# Altium schematic sheet ANALOG_PART1.SchDoc
size A3; SheetNumber: 1; SheetTotal: 3
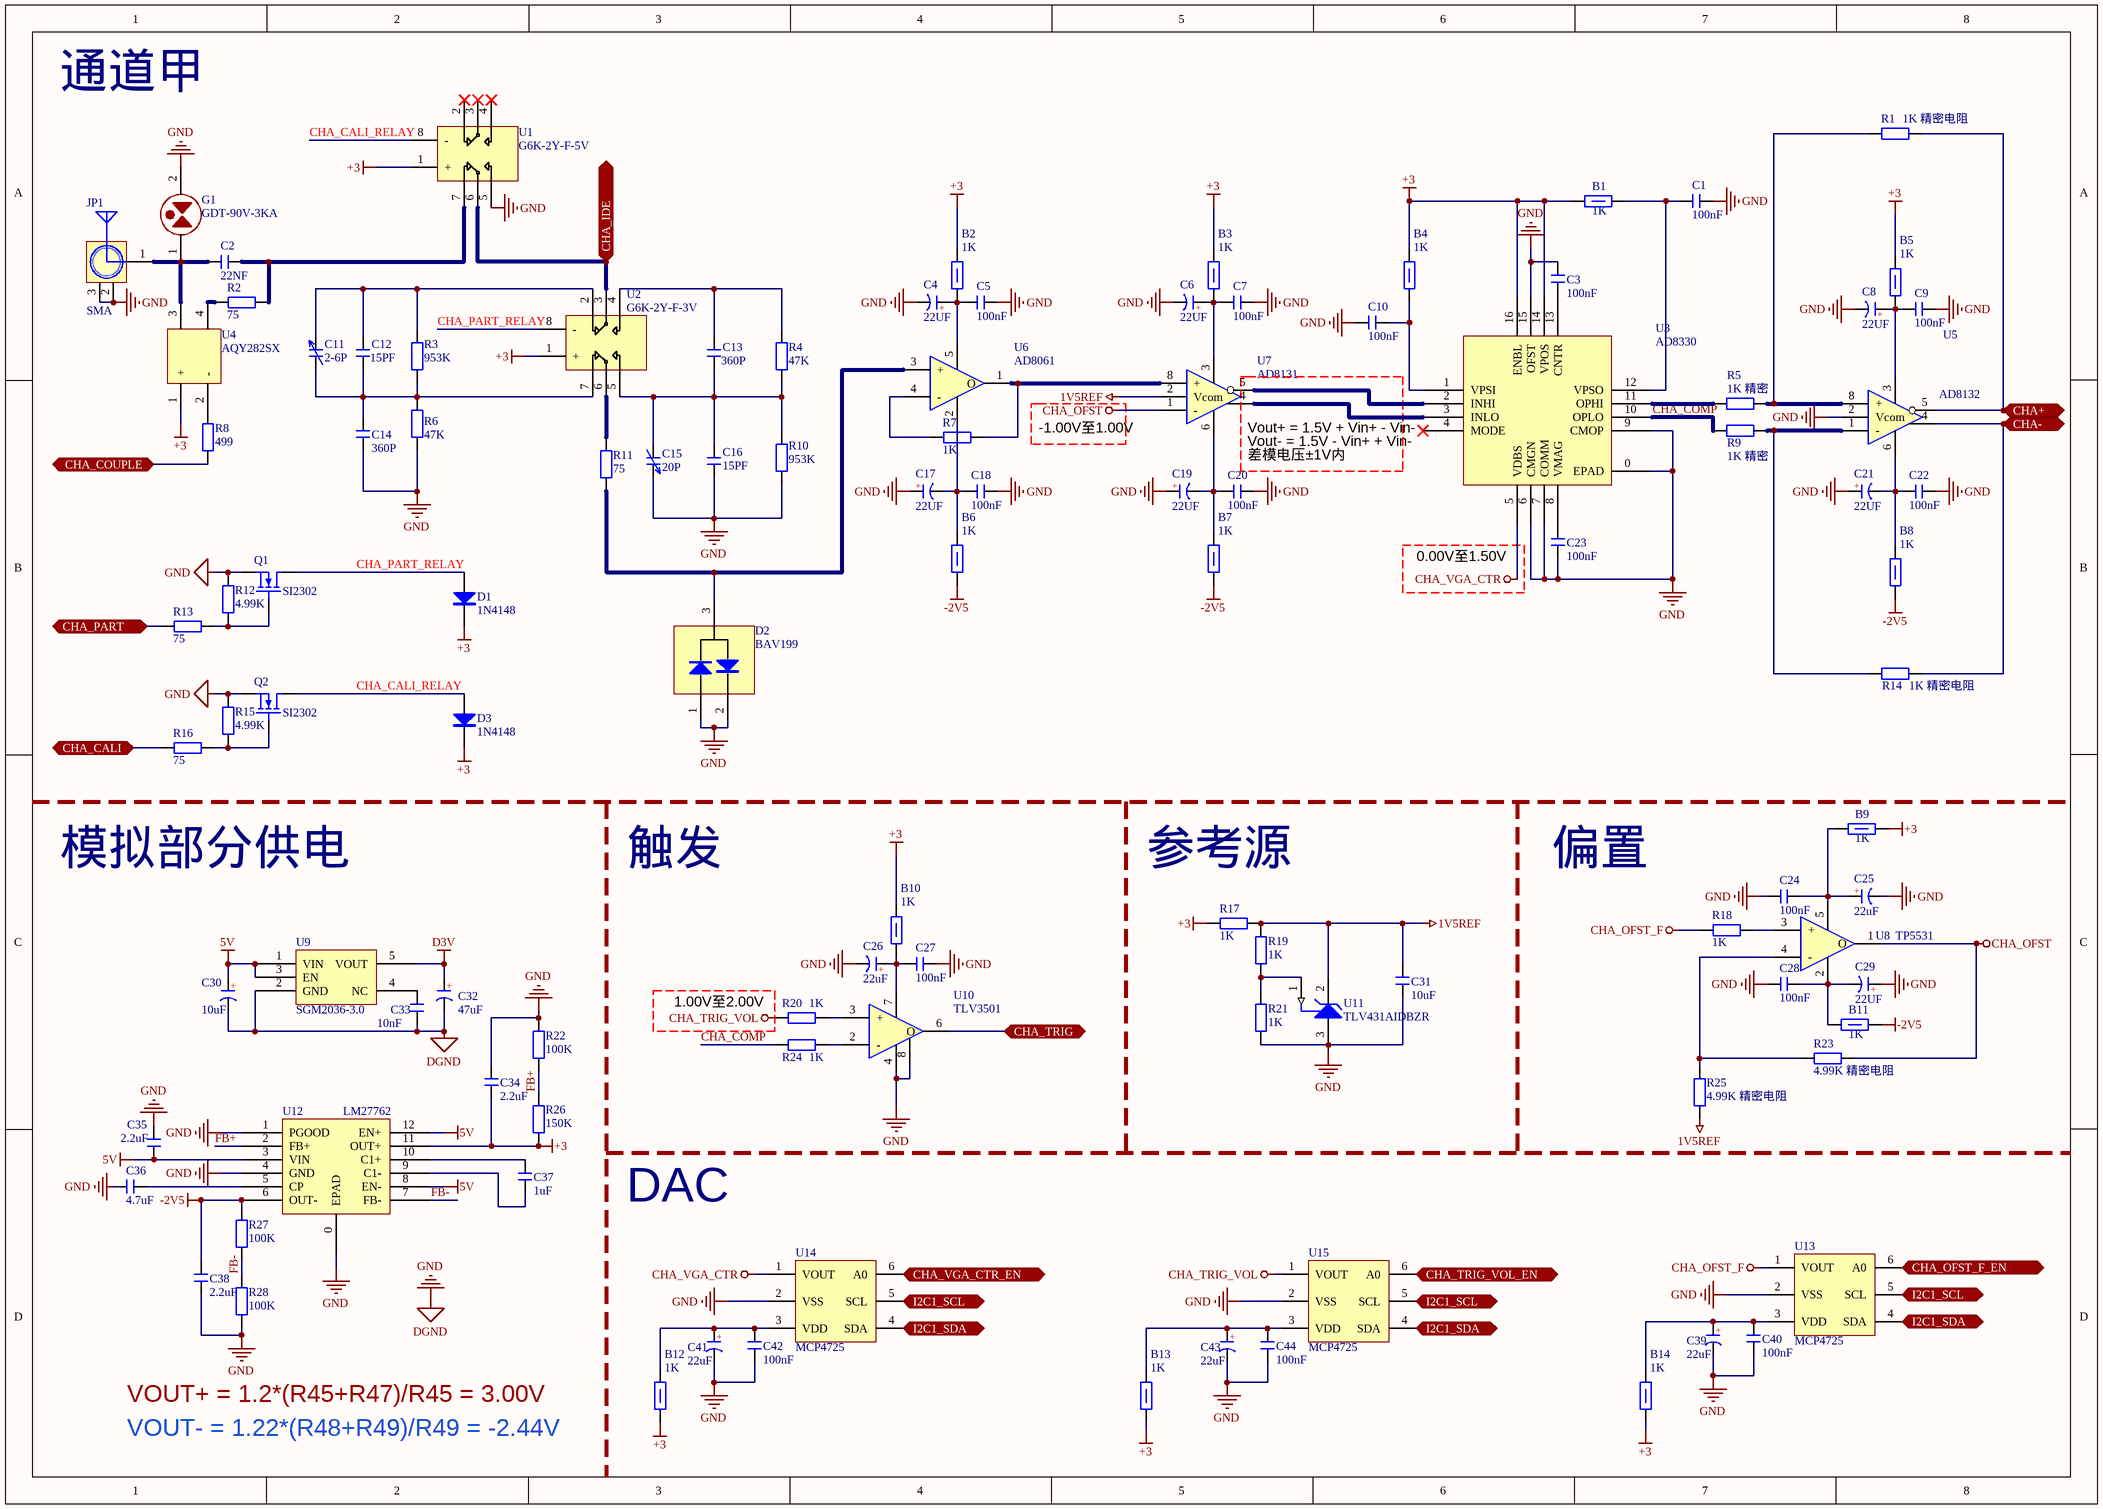
[diagram p0: ANALOG_PART1.SchDoc]

## Parts
B1  1K  [B 0603_L]
B2  1K  [B 0603_L]
B3  1K  [B 0603_L]
B4  1K  [B 0603_L]
B5  1K  [B 0603_L]
B6  1K  [B 0603_L]
B7  1K  [B 0603_L]
B8  1K  [B 0603_L]
B9  1K  [B 0603_L]
B10  1K  [B 0603_L]
B11  1K  [B 0603_L]
B12  1K  [B 0603_L]
B13  1K  [B 0603_L]
B14  1K  [B 0603_L]
C1  100nF  [C 0603_L]
C2  22NF  [C 1206_L]
C3  100nF  [C 0603_L]
C4  22UF  [C 0603_L]
C5  100nF  [C 0603_L]
C6  22UF  [C 0603_L]
C7  100nF  [C 0603_L]
C8  22UF  [C 0603_L]
C9  100nF  [C 0603_L]
C10  100nF  [C 0603_L]
C11  2-6P  [RC-SMD]
C12  15PF  [C 0603_L]
C13  360P  [C 0603_L]
C14  360P  [C 0603_L]
C15  20P  [RC-SMD]
C16  15PF  [C 0603_L]
C17  22UF  [C 0603_L]
C18  100nF  [C 0603_L]
C19  22UF  [C 0603_L]
C20  100nF  [C 0603_L]
C21  22UF  [C 0603_L]
C22  100nF  [C 0603_L]
C23  100nF  [C 0603_L]
C24  100nF  [C 0603_L]
C25  22uF  [C 0603_L]
C26  22uF  [C 0603_L]
C27  100nF  [C 0603_L]
C28  100nF  [C 0603_L]
C29  22UF  [C 0603_L]
C30  10uF  [CD A(3216)]
C31  10uF  [C 0603_L]
C32  47uF  [CD A(3216)]
C33  10nF  [C 0603_L]
C34  2.2uF  [C 0603_L]
C35  2.2uF  [C 0603_L]
C36  4.7uF  [C 0603_L]
C37  1uF  [C 0603_L]
C38  2.2uF  [C 0603_L]
C39  22uF  [C 0603_L]
C40  100nF  [C 0603_L]
C41  22uF  [C 0603_L]
C42  100nF  [C 0603_L]
C43  22uF  [C 0603_L]
C44  100nF  [C 0603_L]
D1  1N4148  [SOD-523_L]
D2  BAV199  [SOT23-3L]
D3  1N4148  [SOD-523_L]
G1  GDT-90V-3KA  [GDT-1812]
JP1  SMA  [SMA_FR]
Q1  SI2302  [SOT23-3L]
Q2  SI2302  [SOT23-3L]
R1  1K 精密电阻  [R 0603_L]
R2  75  [R 0603_L]
R3  953K  [R 0603_L]
R4  47K  [R 0603_L]
R5  1K 精密  [R 0603_L]
R6  47K  [R 0603_L]
R7  1K  [R 0603_L]
R8  499  [R 0603_L]
R9  1K 精密  [R 0603_L]
R10  953K  [R 0603_L]
R11  75  [R 0603_L]
R12  4.99K  [R 0603_L]
R13  75  [R 0603_L]
R14  1K 精密电阻  [R 0603_L]
R15  4.99K  [R 0603_L]
R16  75  [R 0603_L]
R17  1K  [R 0603_L]
R18  1K  [R 0603_L]
R19  1K  [R 0603_L]
R20  1K  [R 0603_L]
R21  1K  [R 0603_L]
R22  100K  [R 0603_L]
R23  4.99K 精密电阻  [R 0603_L]
R24  1K  [R 0603_L]
R25  4.99K 精密电阻  [R 0603_L]
R26  150K  [R 0603_L]
R27  100K  [R 0603_L]
R28  100K  [R 0603_L]
U1  G6K-2Y-F-5V  [G6K-2F-Y]
U2  G6K-2Y-F-3V  [G6K-2F-Y]
U3  AD8330  [LFCSP-16]
U4  AQY282SX  [SOP4_L]
U5  AD8132  [SOP8_L]
U6  AD8061  [SOT23-5]
U7  AD8131  [SOP8_L]
U8  TP5531  [SOT23-5]
U9  SGM2036-3.0  [SOT23-5L]
U10  TLV3501  [SOP8_L]
U11  TLV431AIDBZR  [DBZ0003A_N]
U12  LM27762  [WSON-12]
U13  MCP4725  [SOT23-6L]
U14  MCP4725  [SOT23-6L]
U15  MCP4725  [SOT23-6L]

## Ports
CHA+ (bidir), CHA- (bidir), CHA_CALI (bidir), CHA_COUPLE (bidir), CHA_IDE (bidir), CHA_OFST_F_EN (bidir), CHA_PART (bidir), CHA_TRIG (bidir), CHA_TRIG_VOL_EN (bidir), CHA_VGA_CTR_EN (bidir), I2C1_SCL (bidir), I2C1_SDA (bidir)

## Nets
1V5REF: C31.1 R17.2 R19.2 R25.2 U7.2(Vcom) U11.2(CATHODE)
5V: C30.1(A) C35.2 U9.1(VIN) U9.3(EN) U12.3(VIN) U12.8(EN-) U12.12(EN+)
+3: B1.1 B2.2 B3.2 B4.2 B5.2 B9.2 B10.2 B12.1 B13.1 B14.1 C34.1 D1.2(K) D3.2(K) R17.1 R26.1 U1.1(+) U2.1(+) U3.14(VPOS) U3.16(ENBL) U4.1(+) U12.11(OUT+)
-2V5: B6.1 B7.1 B8.1 B11.2 C38.1 R27.1 U12.6(OUT-)
CHA_OFST: R23.2 U7.1(-) U8.1(O)
CHA_OFST_F: R18.2 U13.1(VOUT)
CHA_TRIG_VOL: R20.1 U15.1(VOUT)
CHA_VGA_CTR: U3.5(VDBS) U14.1(VOUT)
D3V: C32.1(A) U9.5(VOUT)
DGND: C1.1 C3.1 C4.2(K) C5.1 C6.2(K) C7.1 C8.2(K) C9.1 C10.2 C14.1 C15.2 C16.1 C17.1(A) C18.1 C19.1(A) C20.1 C21.1(A) C22.1 C23.2 C24.2 C25.2(K) C26.2(K) C27.1 C28.2 C29.1(A) C30.2(K) C31.2 C32.2(K) C33.1 C34.2 C35.1 C36.1 C38.2 C39.2(K) C40.2 C41.2(K) C42.2 C43.2(K) C44.2 D2.1 D2.2 G1.2 JP1.2(GND) JP1.3(GND) Q1.2 Q2.2 R6.1 R10.1 R12.2 R15.2 R21.1 R22.2 R28.2 U1.5 U3.0(EPAD) U3.6(CMGN) U3.7(COMM) U3.9(CMOP) U3.15(OFST) U5.2(Vcom) U9.2(GND) U10.4 U10.8 U11.3(ANODE) U12.0(EPAD) U12.1(PGOOD) U12.4(GND) U13.2(VSS) U14.2(VSS) U15.2(VSS)  [also labelled GND]
CHA+: R1.2 U5.5 ; port CHA+
CHA-: R14.2 U5.4 ; port CHA-
CHA_CALI: R16.2 ; port CHA_CALI
CHA_CALI_RELAY: D3.1(A) Q2.3 U1.8(-)
CHA_COMP: R9.1 R24.1 U3.10(OPLO)
CHA_COUPLE: R8.1 ; port CHA_COUPLE
CHA_IDE: U1.6 U2.3 ; port CHA_IDE
CHA_OFST_F_EN: U13.6(A0) ; port CHA_OFST_F_EN
CHA_PART: R13.2 ; port CHA_PART
CHA_PART_RELAY: D1.1(A) Q1.3 U2.8(-)
CHA_TRIG: U10.6(O) ; port CHA_TRIG
CHA_TRIG_VOL_EN: U15.6(A0) ; port CHA_TRIG_VOL_EN
CHA_VGA_CTR_EN: U14.6(A0) ; port CHA_VGA_CTR_EN
FB+: R22.1 R26.2 U12.2(FB+)
FB-: R27.2 R28.1 U12.7(FB-)
I2C1_SCL: U13.5(SCL) U14.5(SCL) U15.5(SCL) ; port I2C1_SCL
I2C1_SDA: U13.4(SDA) U14.4(SDA) U15.4(SDA) ; port I2C1_SDA
NetB1_2: B1.2 C1.2 U3.12(VPSO)
NetB2_1: B2.1 C4.1(A) C5.2 U6.5
NetB3_1: B3.1 C6.1(A) C7.2 U7.3
NetB4_1: B4.1 C10.1 U3.1(VPSI)
NetB5_1: B5.1 C8.1(A) C9.2 U5.3
NetB6_2: B6.2 C17.2(K) C18.2 U6.2
NetB7_2: B7.2 C19.2(K) C20.2 U7.6
NetB8_2: B8.2 C21.2(K) C22.2 U5.6
NetB9_1: B9.1 C24.1 C25.1(A) U8.5
NetB10_1: B10.1 C26.1(A) C27.2 U10.7
NetB11_1: B11.1 C28.1 C29.2(K) U8.2
NetB12_2: B12.2 C41.1(A) C42.1 U14.3(VDD)
NetB13_2: B13.2 C43.1(A) C44.1 U15.3(VDD)
NetB14_2: B14.2 C39.1(A) C40.1 U13.3(VDD)
NetC2_1: C2.1 G1.1 JP1.1(ANT) U4.3
NetC2_2: C2.2 R2.2 U1.7
NetC3_2: C3.2 U3.13(CNTR)
NetC11_1: C11.1 C12.1 C14.2 R3.1 R6.2 U2.7
NetC11_2: C11.2 C12.2 R3.2 U2.2
NetC13_1: C13.1 C15.1 C16.2 R4.1 R10.2 U2.5
NetC13_2: C13.2 R4.2 U2.4
NetC23_1: C23.1 U3.8(VMAG)
NetC33_2: C33.2 U9.4(NC)
NetC36_2: C36.2 U12.5(CP)
NetC37_1: C37.1 U12.10(C1+)
NetC37_2: C37.2 U12.9(C1-)
NetD2_3: D2.3 R11.1 U6.3(+)
NetQ1_1: Q1.1 R12.1 R13.1
NetQ2_1: Q2.1 R15.1 R16.1
NetR1_1: R1.1 R5.2 U5.8(+)
NetR2_1: R2.1 U4.4
NetR5_1: R5.1 U3.11(OPHI)
NetR7_1: R7.1 U6.1(O) U7.8(+)
NetR7_2: R7.2 U6.4(-)
NetR8_2: R8.2 U4.2(-)
NetR9_2: R9.2 R14.1 U5.1(-)
NetR11_2: R11.2 U2.6
NetR18_1: R18.1 U8.3(+)
NetR19_1: R19.1 R21.2 U11.1(REF)
NetR20_2: R20.2 U10.3(+)
NetR23_1: R23.1 R25.1 U8.4(-)
NetR24_2: R24.2 U10.2(-)
NetU3_2: U3.2(INHI) U7.5
NetU3_3: U3.3(INLO) U7.4

Not connected (* = marked no-connect by the designer): U1 2* 3* 4*; U3 4(MODE)*

## Notes on the sheet
- 通道甲
- -1.00V至1.00V
- Vout+ = 1.5V + Vin+ - Vin-
- Vout- = 1.5V - Vin+ + Vin-
- 差模电压±1V内
- 0.00V至1.50V
- 模拟部分供电
- 触发
- 参考源
- 偏置
- 1.00V至2.00V
- DAC
- VOUT- = 1.22*(R48+R49)/R49 = -2.44V
- VOUT+ = 1.2*(R45+R47)/R45 = 3.00V
- (in symbol C-CD) +

## Library data of the parts
B1-B14 = B: 贴片磁珠
C1-C3 C5 C7 C9 C10 C12-C14 C16 C18 C20 C22-C24 C27 C28 C31 C33-C38 C40 C42 C44 = C: 无极性贴片电容; 版权归属: 源创客; BOM名称: 无极性贴片电容; 学习资源: www.ooocke.com
C4 C6 C8 C17 C19 C21 C25 C26 C29 C30 C32 C39 C41 C43 = C-CD: 贴片钽电容; 版权归属: 源创客; BOM名称: 贴片钽电容; 学习资源: www.ooocke.com
C11 C15 = CP_SMD: 贴片可调电容
D1 D3 = 1N4148: 高速开关二极管; 版权归属: 源创客; BOM名称: 高速开关二极管; 学习资源: www.ooocke.com
D2 = BAV199: 双肖特基二极管; BOM名称: 肖特基二极管; 版权归属: 源创客; 属性: 40V/2A; 学习资源: www.ooocke.com
G1 = GDT-90V-3KA: 气体放电管
JP1 = SMA: SMA-2.4G射频天线接口; 版权归属: 源创客; BOM名称: SMA-2.4G射频天线接口; 学习资源: www.ooocke.com
Q1 Q2 = SI2302: 场效应管
R1-R28 = R: 贴片电阻; 版权归属: 源创客; BOM名称: 贴片电阻; 学习资源: www.ooocke.com
U1 U2 = G6K-2Y-F-5V: 继电器
U3 = AD8330: 压控放大器
U4 = AQY282SX: 光电固态继电器
U5 = AD8132: 全差分运放; BOM名称: 单路精密运放; 版权归属: 源创客; 学习资源: www.ooocke.com
U6 = AD8061: FET输入运放; BOM名称: 单路精密运放; 版权归属: 源创客; 学习资源: www.ooocke.com
U7 = AD8131: 全差分运放; BOM名称: 单路精密运放; 版权归属: 源创客; 学习资源: www.ooocke.com
U8 = TP5531: 零漂运放; BOM名称: 单路精密运放; 版权归属: 源创客; 学习资源: www.ooocke.com
U9 = SP6201-3.3: 线性稳压器
U10 = TLV3501: 高速比较器; BOM名称: 单路精密运放; 版权归属: 源创客; 学习资源: www.ooocke.com
U11 = CMP-0366-00975-2: Low Voltage Adjustable Precision Shunt Regulator, 39 ppm / degC, 15 mA, -40 to 85 degC, 3-pin SOT-23 (DBZ), Green (RoHS & no Sb/Br); Manufacturer: Texas Instruments; Temp Coeff(Typ)(ppm/ degree C): 39; VO Adj(Max)(V): 6; SubFamily: Shunt Voltage Reference; Min Iz for Regulation(uA): 80; Temp Coeff(Max)(ppm/ degree C): 129; VO Adj(Min)(V): 1.24; Initial Accuracy @ 25/deg C(%): 1; Iout/Iz(Max)(mA): 15; Rating: Catalog; ComponentLink1URL: http://www.ti.com/; ComponentLink2URL: http://www.ti.com/general/docs/lit/getliterature.tsp?genericPartNumber=TLV431A&fileType=pdf; Mounting Technology: Surface Mount; DatasheetVersion: SLVS139T; ComponentLink3URL: http://www.ti.com/litv/pdf/mpds108a; PackageDescription: 3-Pin Plastic Small Outline, Body 2.92 x 1.3 mm, Pitch 0.95 mm; Code_JEDEC: TO-236; Eco-Plan: Green (RoHS & no Sb/Br); ComponentLink2Description: Datasheet; PackageReference: DBZ0003A; PackageVersion: 4203227/B; ComponentLink3Description: Package Specification; PartNumber: TLV431AIDBZR; ComponentLink1Description: Manufacturer URL
U12 = LM27762: DC-DC电源芯片
U13-U15 = MCP4725: 单通道DAC